# EAGLE schematic Main_module_scheme (EAGLE 9.2.2)
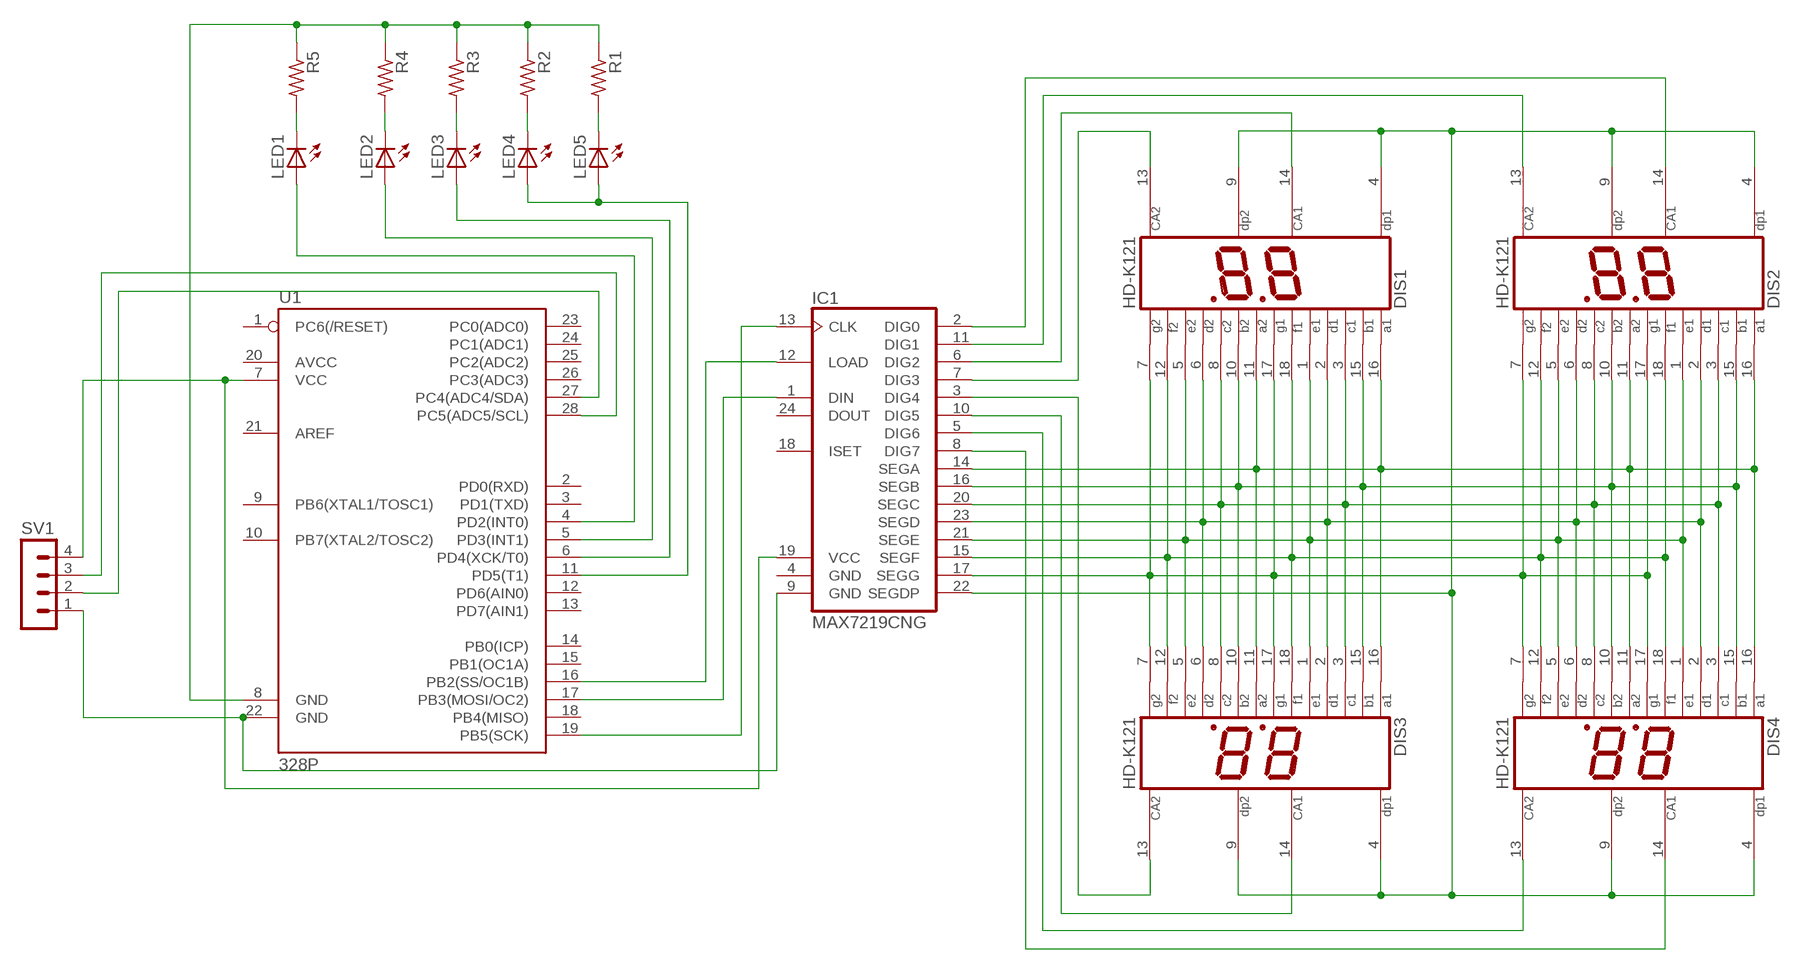
[diagram p0: schematic, sheet 1]

## Parts
DIS1  HD-K121  [HDSP-R]
DIS2  HD-K121  [HDSP-R]
DIS3  HD-K121  [HDSP-R]
DIS4  HD-K121  [HDSP-R]
IC1  MAX7219CNG  [DIL24-3]
LED1  LED5MM  [LED5MM]
LED2  LED5MM  [LED5MM]
LED3  LED5MM  [LED5MM]
LED4  LED5MM  [LED5MM]
LED5  LED5MM  [LED5MM]
R1  FLIPFLOP-RES  [0805-THM]
R2  FLIPFLOP-RES  [0805-THM]
R3  FLIPFLOP-RES  [0805-THM]
R4  FLIPFLOP-RES  [0805-THM]
R5  FLIPFLOP-RES  [0805-THM]
SV1  MA04-1  [MA04-1]
U1  328P  ATMEGA328P_PDIP  [DIP28]

## Nets
N$1: DIS1.11(A2) DIS1.16(A1) DIS2.11(A2) DIS2.16(A1) DIS3.11(A2) DIS3.16(A1) DIS4.11(A2) DIS4.16(A1) IC1.14(SEGA)
N$2: DIS1.10(B2) DIS1.15(B1) DIS2.10(B2) DIS2.15(B1) DIS3.10(B2) DIS3.15(B1) DIS4.10(B2) DIS4.15(B1) IC1.16(SEGB)
N$3: DIS1.3(C1) DIS1.8(C2) DIS2.3(C1) DIS2.8(C2) DIS3.3(C1) DIS3.8(C2) DIS4.3(C1) DIS4.8(C2) IC1.20(SEGC)
N$4: DIS1.2(D1) DIS1.6(D2) DIS2.2(D1) DIS2.6(D2) DIS3.2(D1) DIS3.6(D2) DIS4.2(D1) DIS4.6(D2) IC1.23(SEGD)
N$5: DIS1.1(E1) DIS1.5(E2) DIS2.1(E1) DIS2.5(E2) DIS3.1(E1) DIS3.5(E2) DIS4.1(E1) DIS4.5(E2) IC1.21(SEGE)
N$6: DIS1.12(F2) DIS1.18(F1) DIS2.12(F2) DIS2.18(F1) DIS3.12(F2) DIS3.18(F1) DIS4.12(F2) DIS4.18(F1) IC1.15(SEGF)
N$7: DIS1.7(G2) DIS1.17(G1) DIS2.7(G2) DIS2.17(G1) DIS3.7(G2) DIS3.17(G1) DIS4.7(G2) DIS4.17(G1) IC1.17(SEGG)
N$8: DIS1.4(DP1) DIS1.9(DP2) DIS2.4(DP1) DIS2.9(DP2) DIS3.4(DP1) DIS3.9(DP2) DIS4.4(DP1) DIS4.9(DP2) IC1.22(SEGDP)
N$9: DIS4.14(CA1) IC1.8(DIG7)
N$10: DIS4.13(CA2) IC1.5(DIG6)
N$11: DIS3.14(CA1) IC1.10(DIG5)
N$12: DIS3.13(CA2) IC1.3(DIG4)
N$13: DIS1.13(CA2) IC1.7(DIG3)
N$14: DIS1.14(CA1) IC1.6(DIG2)
N$15: DIS2.13(CA2) IC1.11(DIG1)
N$16: DIS2.14(CA1) IC1.2(DIG0)
N$17: IC1.13(CLK) U1.19(PB5(SCK))
N$18: IC1.1(DIN) U1.17(PB3(MOSI/OC2))
N$19: IC1.12(LOAD) U1.16(PB2(SS/OC1B))
N$20: IC1.9(GND) SV1.1 U1.22(GND)
N$21: IC1.19(VCC) SV1.4 U1.7(VCC)
N$22: LED1.K(C) R5.2
N$23: LED2.K(C) R4.2
N$24: LED3.K(C) R3.2
N$25: LED4.K(C) R2.2
N$26: LED5.K(C) R1.2
N$27: R1.1 R2.1 R3.1 R4.1 R5.1 U1.8(GND)
N$28: LED1.A U1.4(PD2(INT0))
N$29: LED2.A U1.5(PD3(INT1))
N$30: LED3.A U1.6(PD4(XCK/T0))
N$31: LED4.A LED5.A U1.11(PD5(T1))
N$32: SV1.3 U1.28(PC5(ADC5/SCL))
N$33: SV1.2 U1.27(PC4(ADC4/SDA))
Unconnected: IC1.18(ISET) IC1.24(DOUT) U1.1(PC6(/RESET)) U1.2(PD0(RXD)) U1.3(PD1(TXD)) U1.9(PB6(XTAL1/TOSC1)) U1.10(PB7(XTAL2/TOSC2)) U1.12(PD6(AIN0)) U1.13(PD7(AIN1)) U1.14(PB0(ICP)) U1.15(PB1(OC1A)) U1.18(PB4(MISO)) U1.20(AVCC) U1.21(AREF) U1.23(PC0(ADC0)) U1.24(PC1(ADC1)) U1.25(PC2(ADC2)) U1.26(PC3(ADC3))

## Power pins joined to a net without a drawn wire
GND: IC1.4(GND)

## Library data of the parts
DIS1-DIS4 = display-hp:HD-K121: LED DISPLAY 2 x 1 character 7 segment, decimal points right; OC_FARNELL: unknown; OC_NEWARK: unknown
IC1 = maxim:MAX7219CNG: LED DISPLAY DRIVER; MF: MAXIM; MPN: MAX7219CNG; OC_FARNELL: 1523914; OC_NEWARK: 34C4018
LED1-LED5 = adafruit:LED: LED OSRAM: - CHIPLED LG R971, LG N971, LY N971, LG Q971, LY Q971, LO R971, LY R971 LH N974, LH R974 LS Q976, LO Q976, LY Q976 LO Q996 - Hyper CHIPLED LW Q18S LB Q993, LB Q99A, LB R99A - SideLED LS A670, LO A670, LY A670, LG A670, LP A670 LB A673, LV A673, LT A673, LW A673 LH A674 LY A675 LS A676, LA A676, LO A676, LY A676, LW A676 LS A679, LY A679, LG A679 - Hyper Micro SIDELED® LS Y876, LA Y876, LO Y876, LY Y876 LT Y87S - SmartLED LW L88C, LW L88S LB L89C, LB L89S, LG L890 LS L89K, LO L89K, LY L89K LS L896, LA L896, LO L896, LY L896 - TOPLED LS T670, LO T670, LY T670, LG T670, LP T670 LSG T670, LSP T670, LSY T670, LOP T670, LYG T670 LG T671, LOG T671, LSG T671 LB T673, LV T673, LT T673, LW T673 LH T674 LS T676, LA T676, LO T676, LY T676, LB T676, LH T676, LSB T676, LW T676 LB T67C, LV T67C, LT T67C, LS T67K, LO T67K, LY T67K, LW E67C LS E67B, LA E67B, LO E67B, LY E67B, LB E67C, LV E67C, LT E67C LW T67C LS T679, LY T679, LG T679 LS T770, LO T770, LY T770, LG T770, LP T770 LB T773, LV T773, LT T773, LW T773 LH T774 LS E675, LA E675, LY E675, LS T675 LS T776, LA T776, LO T776, LY T776, LB T776 LHGB T686 LT T68C, LB T68C - Hyper Mini TOPLED® LB M676 - Mini TOPLED Santana® LG M470 LS M47K, LO M47K, LY M47K Source: http://www.osram.convergy.de/
R1-R5 = adafruit:FLIPFLOP-RES: Flip Flop resistor An 0805 resistor inside a standard 1/4W 5% resistor. Makes for easy mods
SV1 = con-lstb:MA04-1: PIN HEADER; OC_FARNELL: unknown; OC_NEWARK: unknown
U1 = SparkFun-IC-Microcontroller:ATMEGA328P_PDIP: Atmel 328P Through hole ATMEGA328P uC used in the Arduino 32kb flash, 1k EEPROM, 2k SRAM Datasheet <http://www.sparkfun.com/datasheets/Components/SMD/ATMega328.pdf> SparkFun Products Storefront component: AVR 28 Pin 20MHz 32K 6A/D - ATMega328P <https://www.sparkfun.com/products/9061> (COM-09061) SparkFun Simon Says - Through-Hole Soldering Kit <https://www.sparkfun.com/products/10547> (KIT-10547) SparkFun Learn to Solder - Simon Says <https://www.sparkfun.com/products/13708> (KIT-13708) SparkFun BigTime Watch Kit <https://www.sparkfun.com/products/11734> (KIT-11734) SparkFun ClockIt <https://www.sparkfun.com/products/10930> (KIT-10930) SparkFun Serial Enabled LCD Kit <https://www.sparkfun.com/products/10097> (LCD-10097) SparkFun Simon Tilts - Through Hole Soldering Kit <https://www.sparkfun.com/products/12634> (KIT-12634) SparkFun Frequency Counter Kit <https://www.sparkfun.com/products/10140> (KIT-10140) FabFM Radio Kit <https://www.sparkfun.com/products/11043> (KIT-11043) SparkFun Binary Blaster Kit <https://www.sparkfun.com/products/12037> (KIT-12037) SparkFun Metro-Gnome <https://www.sparkfun.com/products/9236> (KIT-09236) ATmega328 with Arduino Optiboot (Uno) <https://www.sparkfun.com/products/10524> (DEV-10524); PROD_ID: IC-09136